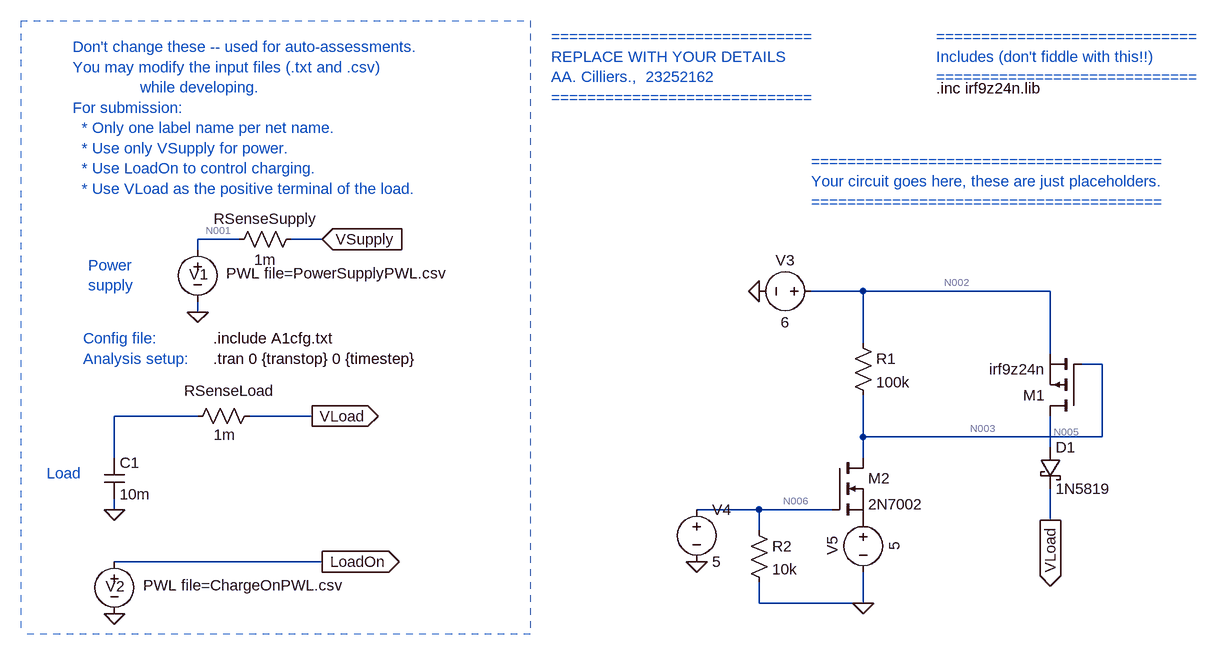
[diagram p0: schematic E344_23252162_A1 - Copy.asc]
E344_23252162_A1 - Copy.asc, the LTspice schematic file:
Version 4
SHEET 1 1824 680
WIRE -2032 -1088 -2096 -1088
WIRE -1904 -1088 -1952 -1088
WIRE -2096 -1072 -2096 -1088
WIRE -1072 -1008 -1152 -1008
WIRE -784 -1008 -1072 -1008
WIRE -2096 -976 -2096 -992
WIRE -1072 -928 -1072 -1008
WIRE -784 -912 -784 -1008
WIRE -704 -896 -736 -896
WIRE -2096 -816 -2224 -816
WIRE -1920 -816 -2016 -816
WIRE -1072 -784 -1072 -848
WIRE -704 -784 -704 -896
WIRE -704 -784 -1072 -784
WIRE -784 -768 -784 -816
WIRE -2224 -752 -2224 -816
WIRE -1072 -752 -1072 -784
WIRE -2224 -672 -2224 -688
WIRE -1232 -672 -1328 -672
WIRE -1120 -672 -1232 -672
WIRE -784 -656 -784 -704
WIRE -1232 -640 -1232 -672
WIRE -1904 -592 -2224 -592
WIRE -1232 -528 -1232 -560
WIRE -1072 -528 -1072 -576
WIRE -1072 -528 -1232 -528
FLAG -2096 -976 0
FLAG -1904 -1088 VSupply
IOPIN -1904 -1088 In
FLAG -1920 -816 VLoad
IOPIN -1920 -816 Out
FLAG -1904 -592 LoadOn
IOPIN -1904 -592 Out
FLAG -2224 -512 0
FLAG -784 -656 VLoad
IOPIN -784 -656 Out
FLAG -2224 -672 0
FLAG -1072 -528 0
FLAG -1232 -1008 0
FLAG -1328 -592 0
SYMBOL voltage -2096 -1088 R0
WINDOW 123 0 0 Left 0
WINDOW 39 0 0 Left 0
WINDOW 3 44 52 Left 2
WINDOW 0 -13 54 Left 2
SYMATTR Value PWL file=PowerSupplyPWL.csv
SYMATTR InstName V1
SYMBOL res -2000 -832 R90
WINDOW 0 -7 47 VBottom 2
WINDOW 3 29 54 VTop 2
SYMATTR InstName RSenseLoad
SYMATTR Value 1m
SYMBOL res -2048 -1072 R270
WINDOW 0 32 56 VTop 2
WINDOW 3 0 56 VBottom 2
SYMATTR InstName RSenseSupply
SYMATTR Value 1m
SYMBOL cap -2240 -752 R0
SYMATTR InstName C1
SYMATTR Value 10m
SYMATTR SpiceLine2 IC=0
SYMBOL voltage -2224 -608 R0
WINDOW 123 0 0 Left 0
WINDOW 39 0 0 Left 0
WINDOW 3 44 52 Left 2
WINDOW 0 -13 54 Left 2
SYMATTR Value PWL file=ChargeOnPWL.csv
SYMATTR InstName V2
SYMBOL pmos -736 -816 R180
SYMATTR InstName M1
SYMATTR Value irf9z24n
SYMATTR Prefix X
SYMATTR SpiceModel irf9z24n
SYMBOL nmos -1120 -752 R0
SYMATTR InstName M2
SYMATTR Value 2N7002
SYMBOL schottky -800 -768 R0
SYMATTR InstName D1
SYMATTR Value 1N5819
SYMATTR Description Diode
SYMATTR Type diode
SYMBOL res -1088 -944 R0
SYMATTR InstName R1
SYMATTR Value 100k
SYMBOL res -1248 -656 R0
SYMATTR InstName R2
SYMATTR Value 10k
SYMBOL voltage -1136 -1008 R90
WINDOW 0 -32 56 VBottom 2
WINDOW 3 32 56 VTop 2
WINDOW 123 0 0 Left 0
WINDOW 39 0 0 Left 0
SYMATTR InstName V3
SYMATTR Value 6
SYMBOL voltage -1328 -688 R0
WINDOW 123 0 0 Left 0
WINDOW 39 0 0 Left 0
SYMATTR InstName V4
SYMATTR Value 5
SYMBOL voltage -1072 -672 R0
WINDOW 0 -32 56 VBottom 2
WINDOW 3 32 56 VTop 2
WINDOW 123 0 0 Left 0
WINDOW 39 0 0 Left 0
SYMATTR InstName V5
SYMATTR Value 5
TEXT -2072 -904 Left 2 !.tran 0 {transtop} 0 {timestep}
TEXT -2072 -936 Left 2 !.include A1cfg.txt
TEXT -2288 -1384 Left 2 ;Don't change these -- used for auto-assessments.\nYou may modify the input files (.txt and .csv) \n               while developing.\nFor submission: \n  * Only one label name per net name.\n  * Use only VSupply for power.\n  * Use LoadOn to control charging.\n  * Use VLoad as the positive terminal of the load.
TEXT -2272 -936 Left 2 ;Config file:
TEXT -2272 -904 Left 2 ;Analysis setup:
TEXT -2328 -728 Left 2 ;Load
TEXT -2264 -1048 Left 2 ;Power\nsupply
TEXT -1552 -1400 Left 2 ;=============================\nREPLACE WITH YOUR DETAILS\nAA. Cilliers.,  23252162\n=============================
TEXT -960 -1320 Left 2 !.inc irf9z24n.lib
TEXT -960 -1400 Left 2 ;=============================\nIncludes (don't fiddle with this!!)\n=============================
TEXT -1152 -1208 Left 2 ;=======================================\nYour circuit goes here, these are just placeholders.\n=======================================
LINE Normal -1584 -1424 -1584 -480 2
LINE Normal -2368 -1424 -1584 -1424 2
LINE Normal -1584 -480 -2368 -480 2
LINE Normal -1584 -496 -1584 -496 2
LINE Normal -2368 -1424 -2368 -480 2

The netlist it stands for:
* E344_23252162_A1 - Copy.asc
V1 N001 0 PWL file=PowerSupplyPWL.csv
RSenseLoad VLoad N004 1m
RSenseSupply N001 VSupply 1m
C1 N004 0 10m IC=0
V2 LoadOn 0 PWL file=ChargeOnPWL.csv
XM1 N005 N003 N002 irf9z24n irf9z24n  ; pins D G S
M2 N003 N006 P001 P001 2N7002
D1 N005 VLoad 1N5819
R1 N002 N003 100k
R2 N006 0 10k
V3 N002 0 6
V4 N006 0 5
V5 P001 0 5
.model D D
.lib standard.dio
.model NMOS NMOS
.model PMOS PMOS
.lib standard.mos
.tran 0 {transtop} 0 {timestep}
.include A1cfg.txt
* Don't change these -- used for auto-assessments.
* You may modify the input files (.txt and .csv)
*                while developing.
* For submission:
*   * Only one label name per net name.
*   * Use only VSupply for power.
*   * Use LoadOn to control charging.
*   * Use VLoad as the positive terminal of the load.
* Config file:
* Analysis setup:
* Load
* Power
* supply
* =============================
* REPLACE WITH YOUR DETAILS
* AA. Cilliers.,  23252162
* =============================
.inc irf9z24n.lib
* =============================
* Includes (don't fiddle with this!!)
* =============================
* =======================================
* Your circuit goes here, these are just placeholders.
* =======================================
.backanno
.end

* Results of the author's LTspice run, read from the files saved beside the schematic
* Operating Point, zero values left out:
*   V(n001) = 25 V
*   V(vsupply) = 25 V
*   V(n002) = 6 V
*   V(n005) = 2.93 mV
*   V(n003) = 6 V
*   V(n006) = 5 V
*   V(p001) = 5 V
*   Id(M2) = 1.034 pA
*   Is(M2) = -1.034 pA
*   I(C1) = 2.726 µA
*   I(D1) = 2.726 µA
*   I(R2) = 500 µA
*   I(R1) = 8.032 pA
*   I(Rsenseload) = 2.726 µA
*   I(V5) = 2.039 pA
*   I(V4) = -500 µA
*   I(V3) = -2.726 µA
*   Ix(m1:1) = -2.726 µA
*   Ix(m1:2) = 5.997 pA
*   Ix(m1:3) = 2.726 µA
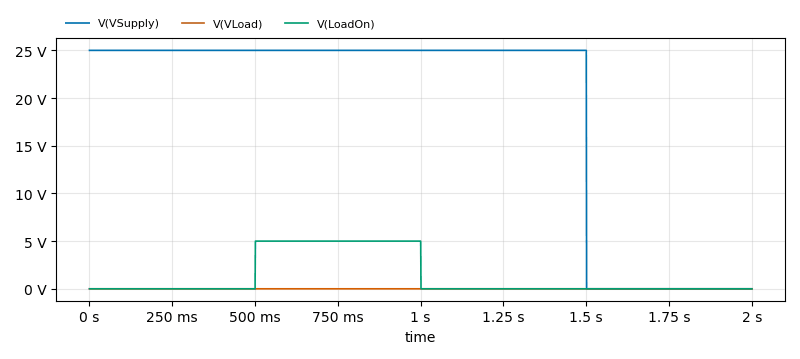
[diagram p1: Transient Analysis of E344_23252162_A1 - Copy.asc, plotted from the saved traces]
* Transient Analysis, 1 run:
*   V(VSupply): min 0 V, max 25 V, average 18.76 V, rms 21.65 V, last 0 V
*   V(VLoad): min 5.452 nV, max 545.2 µV, average 272.6 µV, rms 319.6 µV, last 545.2 µV
*   V(LoadOn): min 0 V, max 5 V, average 1.25 V, rms 2.5 V, last 0 V